# EAGLE design MICRO-USB-B (EAGLE 6.2)
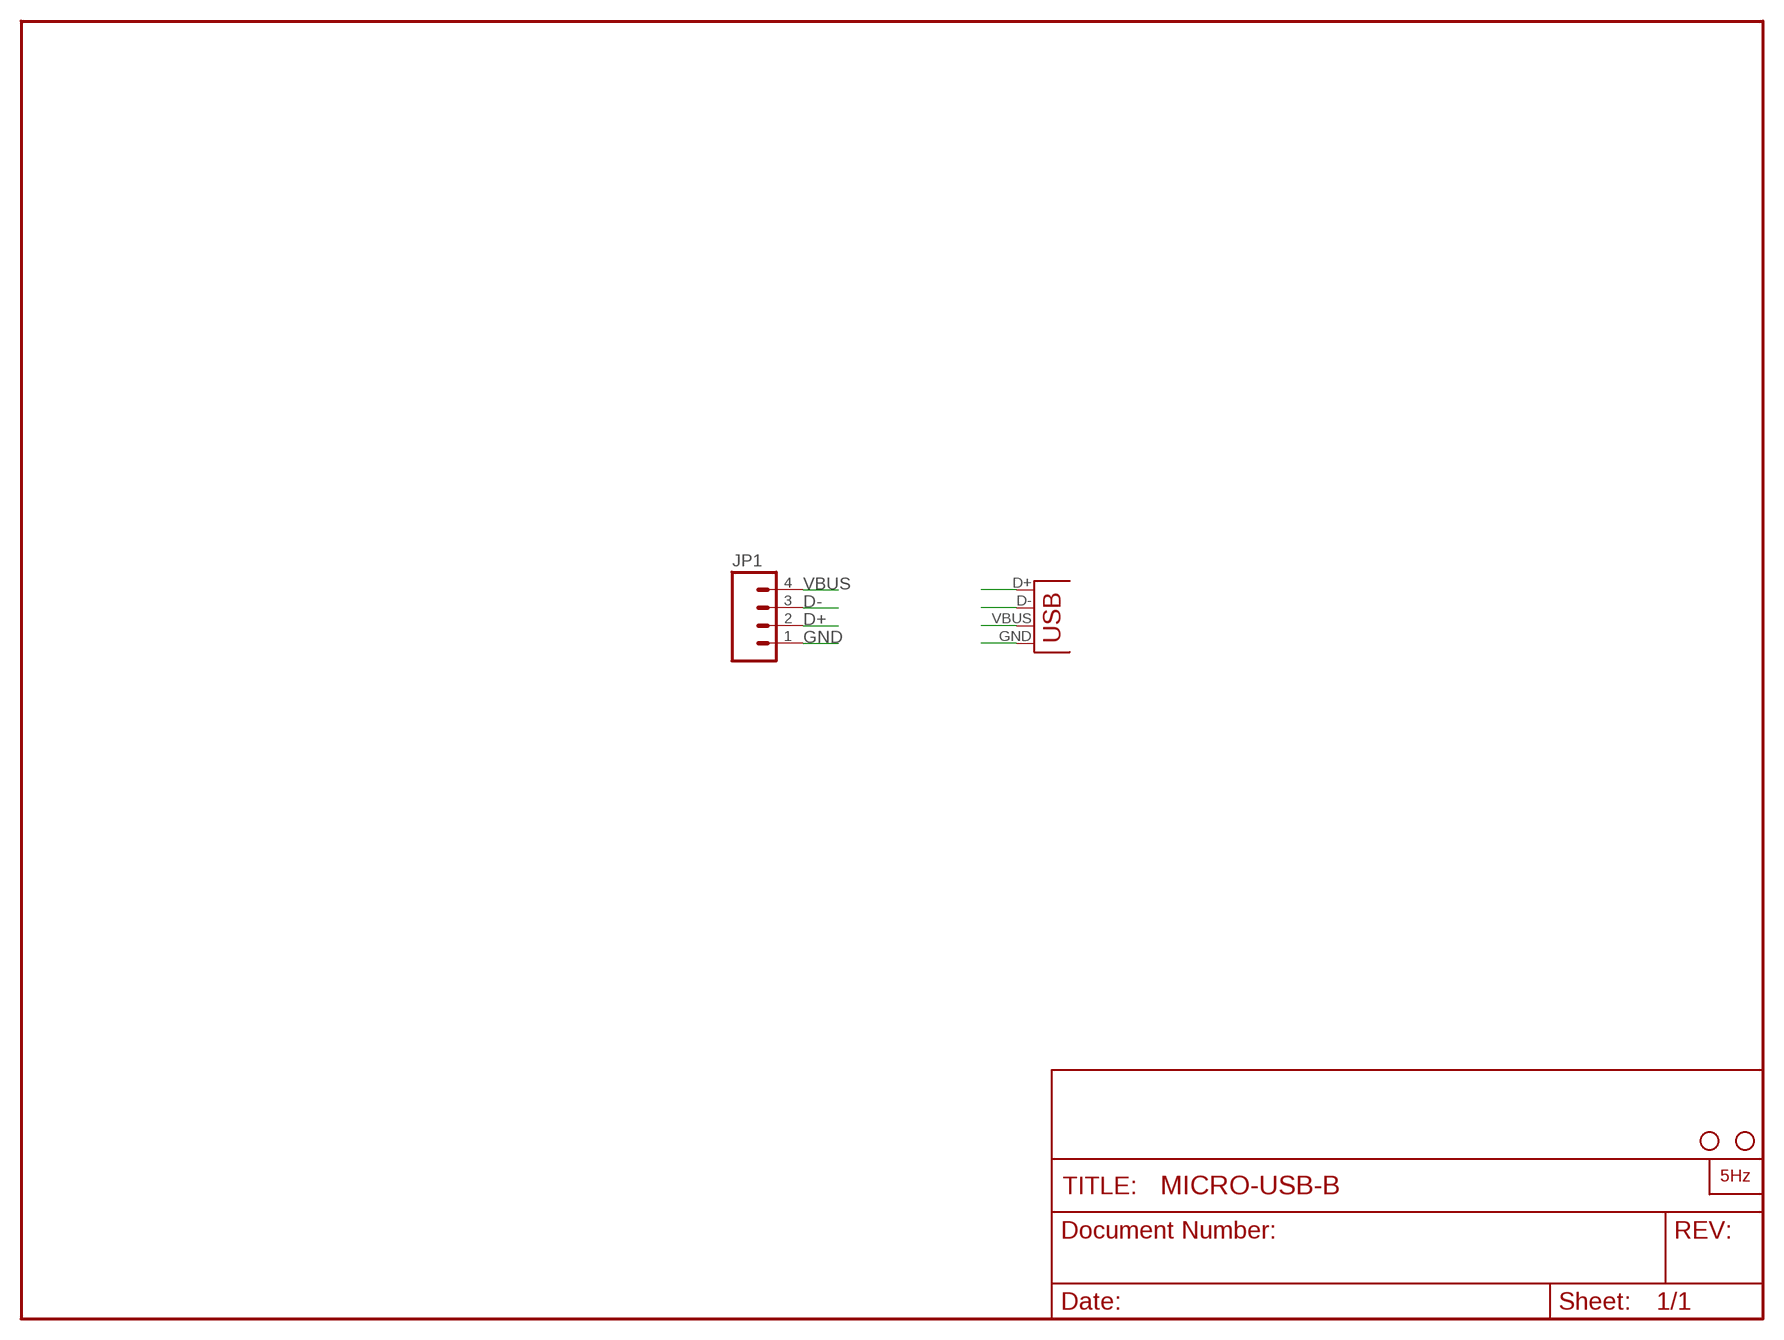
[diagram p0: schematic, sheet 1]

## Parts
JP1  M04PTH  [1X04]
JP3  STAND-OFF  [STAND-OFF]
JP4  STAND-OFF  [STAND-OFF]
U$1  LOGO2_SILKC5MM  [CIRCULO2_5MM]
X1  USB-MICROB  [USB-MICROB]

## Nets
D+: JP1.2 X1.D+
D-: JP1.3 X1.D-
GND: JP1.1 X1.GND
VBUS: JP1.4 X1.VBUS

## Library data of the parts
JP1 = SparkFun:M04: Header 4 Standard 4-pin 0.1" header. Use with straight break away headers (SKU : PRT-00116), right angle break away headers (PRT-00553), swiss pins (PRT-00743), machine pins (PRT-00117), and female headers (PRT-00115). Molex polarized connector foot print use with SKU : PRT-08231 with associated crimp pins and housings.
JP3 JP4 = SparkFun:STAND-OFF: Stand Off This is the mechanical footprint for a #4 phillips button head screw. Use the keepout ring to avoid running the screw head into surrounding components. SKU : PRT-00447
U$1 = LOGO:LOGO2_SILK: PRINCIPAL
X1 = SparkFun:USB: USB Connectors USB-B-PTH is fully proven SKU : PRT-00139 USB-miniB is fully proven SKU : PRT-00587 USB-A-PCB is untested. USB-A-H is throughly reviewed, but untested. Spark Fun Electronics SKU : PRT-00437 USB-B-SMT is throughly reviewed, but untested. Needs silkscreen touching up. USB-A-S has not been used/tested USB-MB-H has not been used/tested

## Board
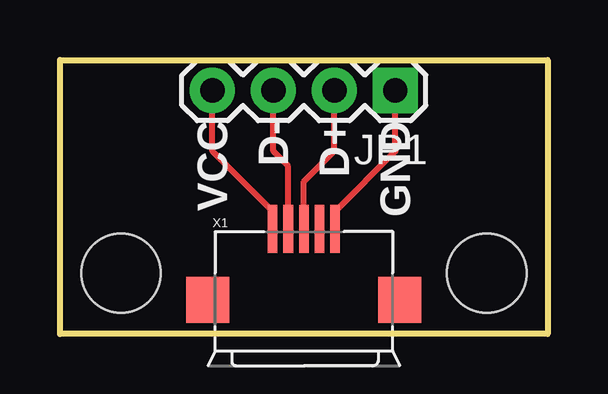
[diagram p1: board, top side]
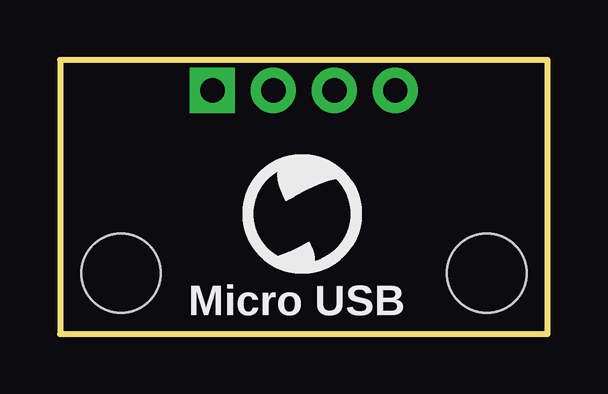
[diagram p2: board, bottom side, seen from below]

Size 20.32 x 11.43 mm. Coordinates in mm from the lower left corner, seen from the top.
Outline: 0,0 0,11.43 20.32,11.43 20.32,0 0,0
Copper layers (1*16): Top 0.035mm / dielectric 1.5mm / Bottom 0.035mm
Design rules: minimum track width 8mil, minimum drill 20mil, track to track 8mil, track to pad 8mil, pad to pad 8mil, via to via 8mil, smd to smd 8mil, copper to edge 9mil, drill to drill 8mil, minimum pad ring 12mil, minimum via ring 10mil, stop-mask expansion 4mil, vias tented up to drill 20mil, thermal gap 10mil

### Footprints (pad centres in the part's own frame; a part is rotated, then mirrored left to right if it is on the bottom)
1X04 = drill 1.016 pad 1.88 square: 1 0,0 | drill 1.016 pad 1.88: 2 2.54,0; 3 5.08,0; 4 7.62,0
STAND-OFF = hole 3.302: 0,0
USB-MICROB = smd 0.4 x 2: D+ 0,3.1; D- -0.65,3.1; GND 1.3,3.1; ID 0.65,3.1; VBUS -1.3,3.1 | smd 1.8 x 1.9: GND@2 -4,0.15; GND@3 4,0.15

### Placement (x,y rotation side)
JP1  13.97,10.16 180 top
JP3  17.78,2.54 0 top
JP4  2.54,2.54 0 top
U$1  12.7,2.54 0 bottom
X1  10.16,1.27 0 top

### Tracks (layer width: path | path; a pad name or v marks a point on that pad's centre or on a via)
D+
  Top 0.254: JP1.2 11.43,7.62 10.16,6.35 X1.D+
D-
  Top 0.254: JP1.3 8.89,7.62 9.51,7 X1.D-
GND
  Top 0.254: JP1.1 13.97,7.62 11.46,5.11 X1.GND
VBUS
  Top 0.254: X1.VBUS 8.86,3.84 8.89,3.81 8.89,5.08 6.35,7.62 JP1.4

### Text on the board
tPlace: VCC | D- | D+ | GND
bPlace: Micro USB